# EasyEDA Pro project jlcProject.epro, schematic Schematic3
Create Date: 2025-03-28; Page Name: P1; Project Name: 电综; Schematic Name: Schematic3; Update Date: 2025-04-21; Company: 嘉立创EDA; Page Size: A4; Version: V1.0
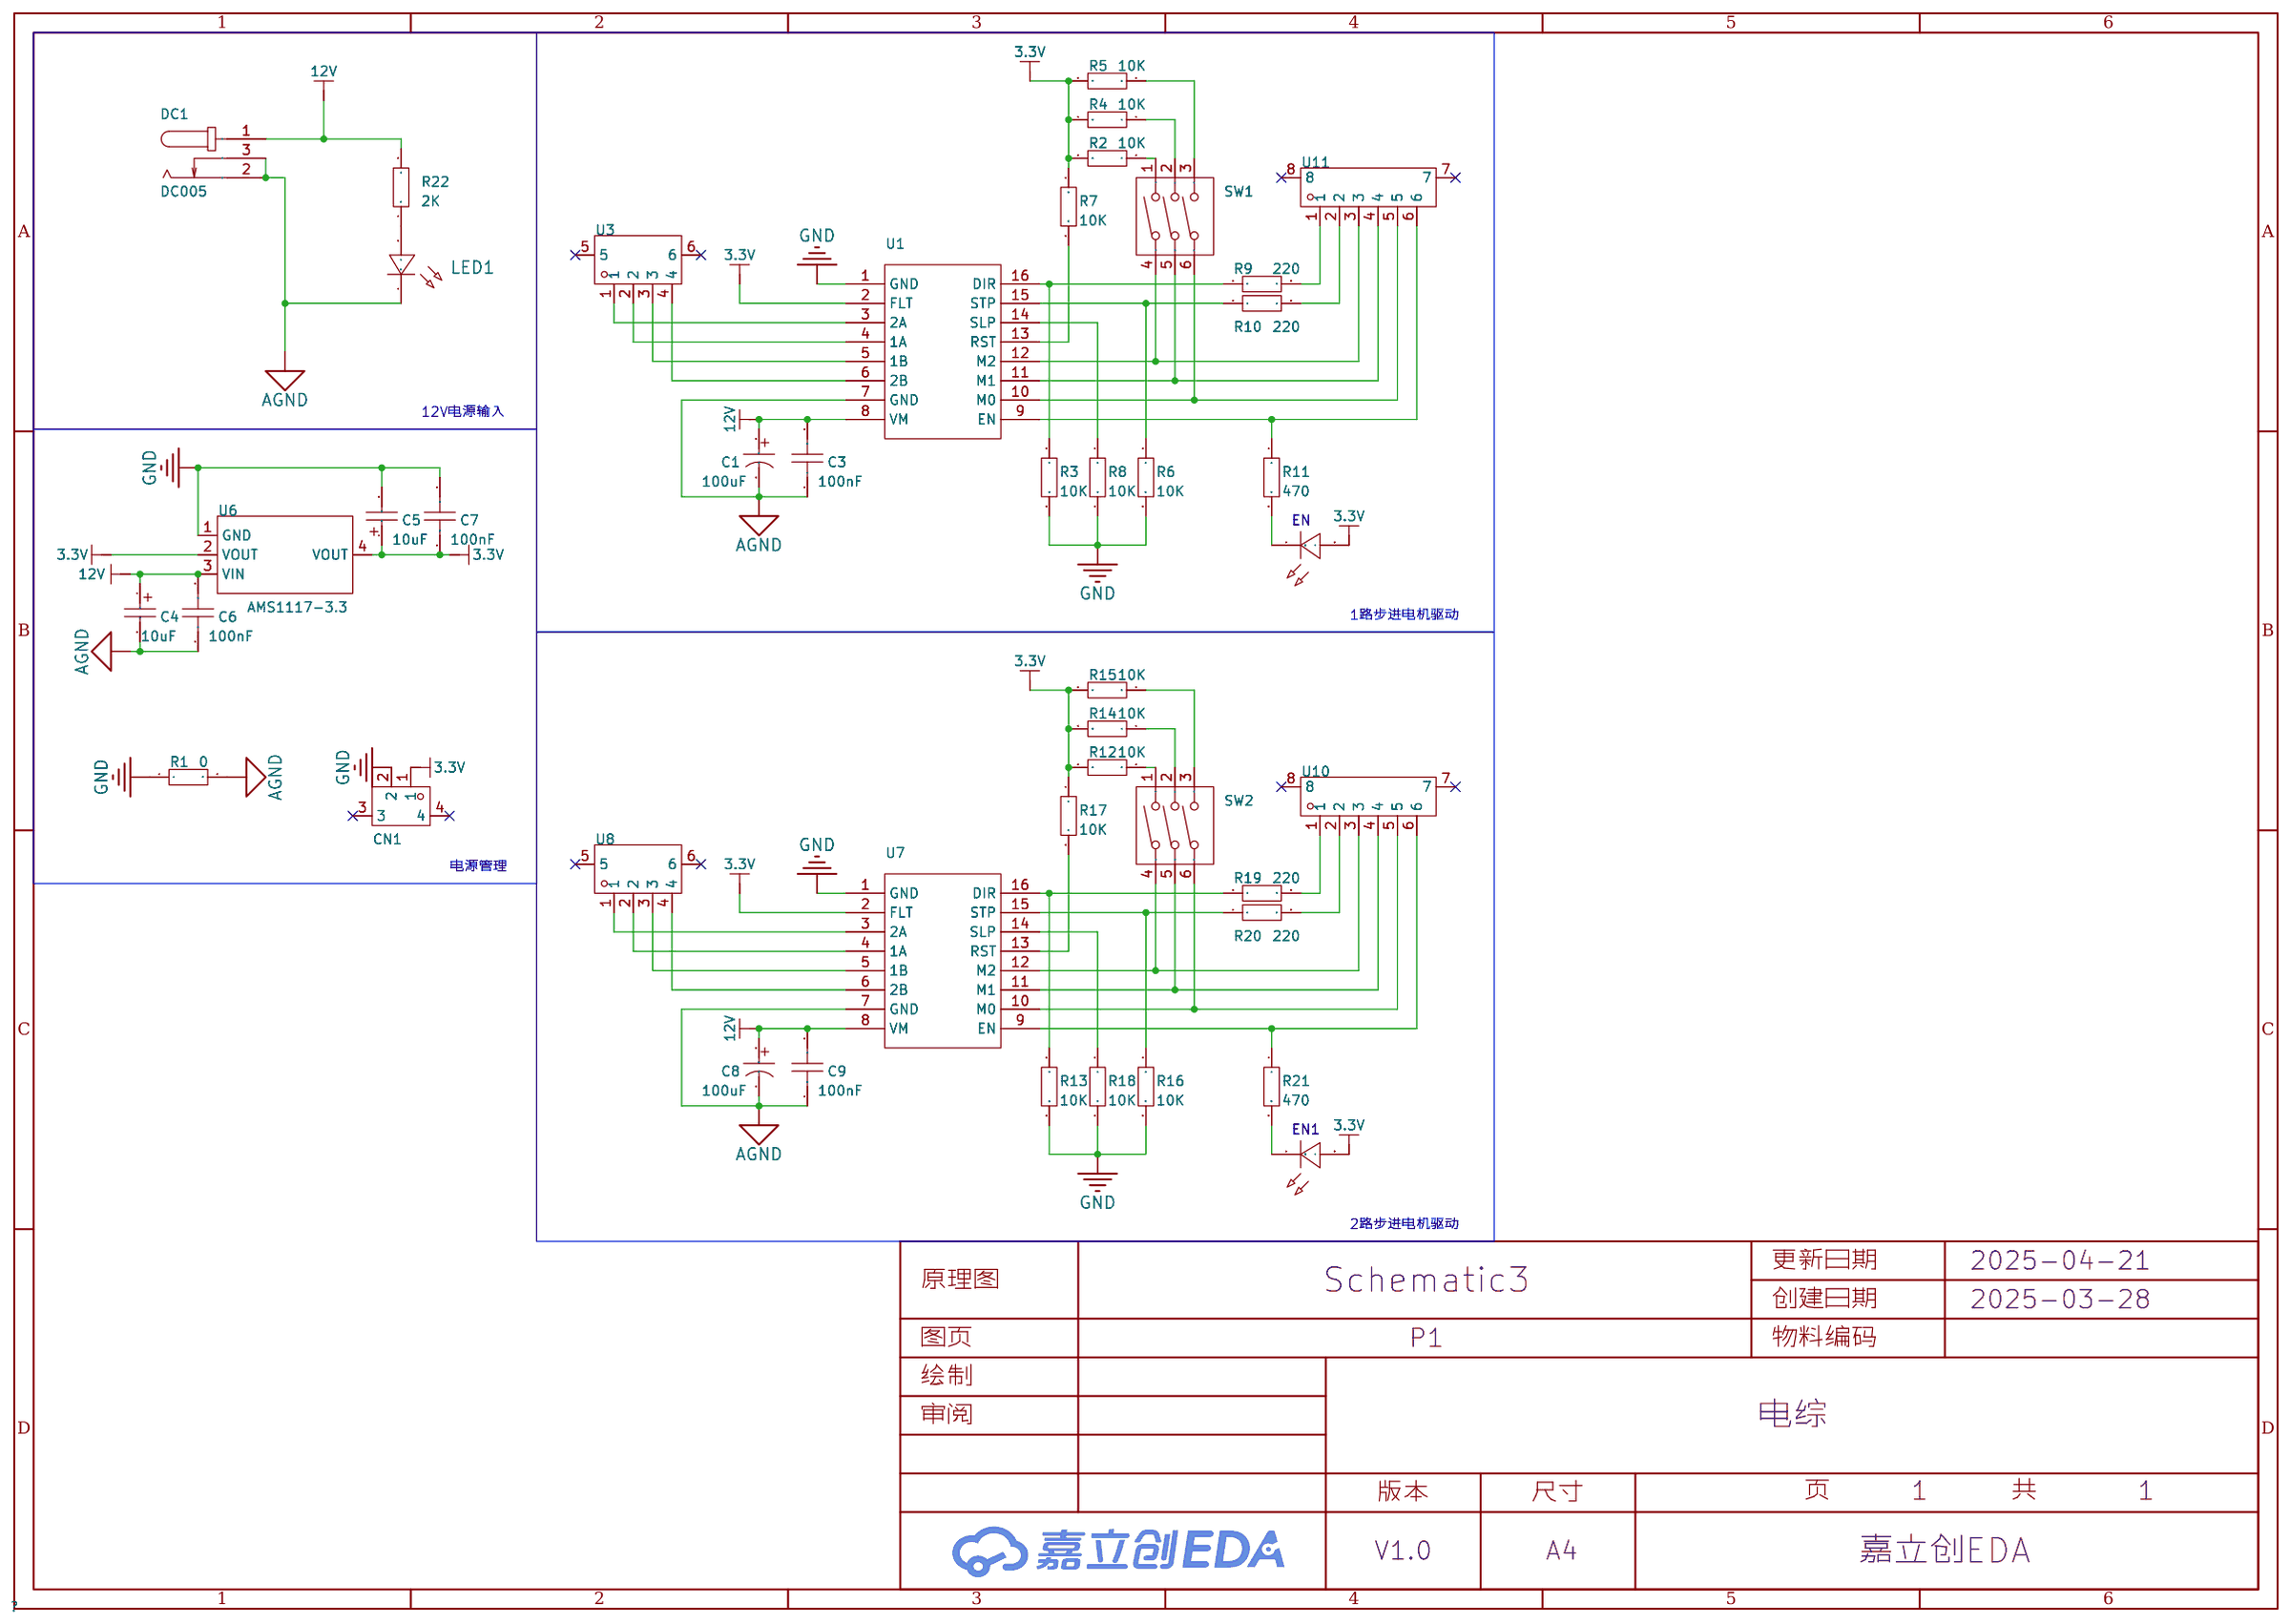
[diagram p0: schematic sheet]

## Parts
C1  100uF  [CAP-SMD_BD6.3-L6.6-W6.6-LS7.6-FD]
C3  100nF  [C0805]
C4  10uF  [CASE-D_7343]
C5  10uF  [CASE-B_3528]
C6  100nF  [C0805]
C7  100nF  [C0805]
C8  100uF  [CAP-SMD_BD6.3-L6.6-W6.6-LS7.6-FD]
C9  100nF  [C0805]
CN1  ZX-XH2.54-2PWT  [CONN-SMD_2P-P2.54_MEGASTAR_ZX-XH2.54-2PWT]
DC1  DC005  [DC-IN-TH_DC005]
EN  -  [LED_0805]
EN1  -  [LED_0805]
LED1  -  [LED_0805]
R1  0  [R0805]
R2  10K  [R0805]
R3  10K  [R0805]
R4  10K  [R0805]
R5  10K  [R0805]
R6  10K  [R0805]
R7  10K  [R0805]
R8  10K  [R0805]
R9  220  [R0805]
R10  220  [R0805]
R11  470  [R0805]
R12  10K  [R0805]
R13  10K  [R0805]
R14  10K  [R0805]
R15  10K  [R0805]
R16  10K  [R0805]
R17  10K  [R0805]
R18  10K  [R0805]
R19  220  [R0805]
R20  220  [R0805]
R21  470  [R0805]
R22  2K  [R0805]
SW1  DSWB03LHGET  [SW-TH_DSWB03LHGET]
SW2  DSWB03LHGET  [SW-TH_DSWB03LHGET]
U1  -  [DRV8825驱动模块]
U3  ZX-XH2.54-4PWT  [CONN-SMD_4P-P2.50-WAFER-254W-4P]
U6  AMS1117-3.3  [SOT-223-3_L6.5-W3.4-P2.30-LS7.0-BR]
U7  -  [DRV8825驱动模块]
U8  ZX-XH2.54-4PWT  [CONN-SMD_4P-P2.50-WAFER-254W-4P]
U10  ZX-XH2.54-6PLT  [CONN-SMD_6P-P2.50_ZX-XH2.54-6PLT]
U11  ZX-XH2.54-6PLT  [CONN-SMD_6P-P2.50_ZX-XH2.54-6PLT]

## Library data of the parts
C1 C8 = RVT1V101M0607: 容值:100uF;精度:±20%;额定电压:35V;纹波电流:69mA@120Hz;等效串联电阻(ESR):-;; LCSC Part Name: 100uF ±20% 35V; Supplier Part: C72478; Manufacturer: ROQANG(容强); Supplier Footprint: SMD,D6.3xL7.7mm; JLCPCB Part Class: Extended Part; Datasheet: https://atta.szlcsc.com/upload/public/pdf/source/20170325/1490427950282.pdf; Supplier: LCSC; Tolerance: ±20%; Voltage Rating: 35V; Ripple Current: 69mA@120Hz; Diameter: 6.3mm; Height - Seated (Max): 7.7mm; Lifetime: 2000hrs@105℃; Operating Temperature: -40℃~+105℃
C3 C6 C7 C9 = CAP_0805: Supplier Footprint: 0805
C4 = TAJD106K035RNJ: 容值:10uF;精度:±10%;额定电压:35V;等效串联电阻:1Ω@100kHz;; LCSC Part Name: 10uF ±10% 35V; Supplier Part: C7221; Manufacturer: Kyocera AVX; Supplier Footprint: CASE-D-7343; JLCPCB Part Class: Extended Part; Datasheet: https://atta.szlcsc.com/upload/public/pdf/source/20160107/1457707750344.pdf; Supplier: LCSC; Tolerance: ±10%; Rated Voltage: 35V; Equivalent Series Resistance(ESR): 1Ω@100kHz; Operating Temperature: -55℃~+125℃
C5 = TAJB106K016RNJ: 容值:10uF;精度:±10%;额定电压:16V;等效串联电阻:2.8Ω@100kHz;; LCSC Part Name: 10uF ±10% 16V; Supplier Part: C7193; Manufacturer: Kyocera AVX; Supplier Footprint: CASE-B-3528; JLCPCB Part Class: Extended Part; Datasheet: https://atta.szlcsc.com/upload/public/pdf/source/20160107/1457707750344.pdf; Supplier: LCSC; Tolerance: ±10%; Rated Voltage: 16V; Equivalent Series Resistance(ESR): 2.8Ω@100kHz; Operating Temperature: -55℃~+125℃
CN1 = ZX-XH2.54-2PWT: 插针结构:1x2P;间距:2.5mm;安装方式:卧贴;参考系列:XH;总PIN数:2P;排数:1;每排PIN数:2;行距:-;额定电流:-;触头材质:黄铜;触头镀层:锡;工作温度范围:-;; LCSC Part Name: 1x2P 间距:2.5mm 卧贴 系列:XH; Supplier Part: C7429671; Manufacturer: Megastar(兆星); Supplier Footprint: SMD,P=2.5mm,卧贴; JLCPCB Part Class: 扩展库; Datasheet: https://atta.szlcsc.com/upload/public/pdf/source/20230619/D2020A0565D707024C90AEAD14B7AF42.pdf; Supplier: LCSC; Pins Structure: 1x2P; Pitch: 2.5mm; Mounting Type: 卧贴; Reference Series: XH; Number of Pins: 2P; Number of Rows: 1; Number of PINs Per Row: 2; Contact Material: 黄铜; Contact Plating: 锡; Supplementary Features: 辅助焊脚; Color: 米色; Z-Height of the Board: 6.2mm; X-Length of Bottom Edge on Board (Spacing Line): 10mm; Y-Width of Bottom Edge on Board: 10.5mm
DC1 = DC005: 连接器类型:DC电源插座;安装方式:弯插;触点内径:2mm;触点外径:6.3mm;额定电流:500mA;额定电压:30V;工作温度范围:-25℃~+70℃;; LCSC Part Name: DC电源插座 内径:2mm 外径:6.3mm; Supplier Part: C431533; Manufacturer: SHOU HAN(首韩); Supplier Footprint: 插件; JLCPCB Part Class: Extended Part; Datasheet: https://atta.szlcsc.com/upload/public/pdf/source/20190925/C431533_4751811035784AC1D38EBC85F7905E99.pdf; Supplier: LCSC; Connector Type: DC电源插座; Mounting Style: 弯插; Inside Contact Diameter: 2mm; Outside Contact Diameter: 6.3mm; Current Rating (Max): 500mA; Voltage Rating (Max): 30V; Operating Temperature Range: -25℃~+70℃
EN EN1 = LED_0805-G: Supplier Footprint: 0805
LED1 = LED_0805-R: Supplier Footprint: 0805
R1-R22 = Res_0805: Supplier Footprint: 0805
SW1 SW2 = DSWB03LHGET: 类型:平拨,凸起式;电路结构:单刀单掷;开关位数:3位;使用寿命:-;颜色:红色;; LCSC Part Name: 间距2.54mm 平拨,凸起式 3位拨码开关; Supplier Part: C99420; Manufacturer: YE; Supplier Footprint: 插件; JLCPCB Part Class: Extended Part; Datasheet: https://atta.szlcsc.com/upload/public/pdf/source/20170330/1490854274194.pdf; Supplier: LCSC; Type: 平拨,凸起式; Circuit: 单刀单掷; Number of Positions: 3位; Lead Pitch: 2.54mm; Color: 红色
U1 U7 = DRV8825模块
U3 U8 = ZX-XH2.54-4PWT: 插针结构:1x4P;间距:2.5mm;安装方式:卧贴;参考系列:XH;总PIN数:4P;排数:1;每排PIN数:4;行距:-;额定电流:-;触头材质:黄铜;触头镀层:锡;工作温度范围:-;; LCSC Part Name: 1x4P 间距:2.5mm 卧贴 系列:XH; Supplier Part: C7429673; Manufacturer: Megastar(兆星); Supplier Footprint: SMD,P=2.5mm,卧贴; JLCPCB Part Class: Extended Part; Datasheet: https://atta.szlcsc.com/upload/public/pdf/source/20230619/EC43AB8145C2F357FC1C90A7DDB889C6.pdf; Supplier: LCSC; Pins Structure: 1x4P; Pitch: 2.5mm; Mounting Type: 卧贴; Reference Series: XH; Number of Pins: 4P; Number of Rows: 1; Number of PINs Per Row: 4; Contact Material: 黄铜; Contact Plating: 锡; Supplementary Features: 辅助焊脚; Color: 米色; Z-Height of the Board: 6.2mm; X-Length of Bottom Edge on Board (Spacing Line): 15mm; Y-Width of Bottom Edge on Board: 10.5mm
U6 = AMS1117-3.3_C6186: 输出类型:固定;工作电压:-;输出电压:3.3V;输出电流:1A;电源纹波抑制比(PSRR):72dB@(120Hz);输出极性:正极;; LCSC Part Name: 输出3.3V 1A; Supplier Part: C6186; Manufacturer: AMS; Supplier Footprint: SOT-223; JLCPCB Part Class: Basic Part; Datasheet: https://atta.szlcsc.com/upload/public/pdf/source/20180727/C6186_7A095716F0823C02F1997A905E26C086.pdf; Supplier: LCSC; Output Type: 固定; Output Voltage: 3.3V; Output Current: 1A; Power Supply Rejection Ratio (PSRR): 72dB@(120Hz); Voltage Dropout: 1.3V@(800mA); Features: 过流保护(OCP)；热关断(TSD); Output Configuration: 正极; Number of Outputs: 1
U10 U11 = ZX-XH2.54-6PLT: 插针结构:1x6P;间距:2.5mm;安装方式:立贴;参考系列:XH;总PIN数:6P;排数:1;每排PIN数:6;行距:-;额定电流:-;触头材质:黄铜;触头镀层:锡;工作温度范围:-;; LCSC Part Name: 1x6P 间距:2.5mm 立贴 系列:XH; Supplier Part: C7429684; Manufacturer: Megastar(兆星); Supplier Footprint: SMD,P=2.5mm; JLCPCB Part Class: 扩展库; Datasheet: https://atta.szlcsc.com/upload/public/pdf/source/20230619/BCBF0CFD05E3F8E61711B90D8A4988B4.pdf; Supplier: LCSC; Pins Structure: 1x6P; Pitch: 2.5mm; Mounting Type: 立贴; Reference Series: XH; Number of Pins: 6P; Number of Rows: 1; Number of PINs Per Row: 6; Contact Material: 黄铜; Contact Plating: 锡; Supplementary Features: 辅助焊脚; Color: 米色; Z-Height of the Board: 8mm; X-Length of Bottom Edge on Board (Spacing Line): 20mm; Y-Width of Bottom Edge on Board: 8.3mm

## Nets
3.3V: C5.1 C7.2 CN1.1 EN.2(A) EN1.2(A) R2.2 R4.2 R5.2 R7.1 R12.2 R14.2 R15.2 R17.1 U1.2(FLT) U6.2(VOUT) U6.4(VOUT) U7.2(FLT)
12V: C1.1 C3.2 C4.1 C6.2 C8.1 C9.2 DC1.1 R22.2 U1.8(VM) U6.3(VIN) U7.8(VM)
AGND: C1.2 C3.1 C4.2 C6.1 C8.2 C9.1 DC1.2 DC1.3 LED1.1(C) R1.2 U1.7(GND) U7.7(GND)
GND: C5.2 C7.1 CN1.2 R1.1 R3.2 R6.2 R8.2 R13.2 R16.2 R18.2 U1.1(GND) U6.1(GND) U7.1(GND)
$1N1102: U1.3(2A) U3.1
$1N1109: U1.4(1A) U3.2
$1N1116: U1.5(1B) U3.3
$1N1123: U1.6(2B) U3.4
$1N1274: R11.1 U1.9(EN) U11.6
$1N1506: SW1.4 U1.12(M2) U11.3
$1N1515: SW1.5 U1.11(M1) U11.4
$1N1524: SW1.6 U1.10(M0) U11.5
$1N1862: R4.1 SW1.2
$1N1866: R5.1 SW1.3
$1N1873: R2.1 SW1.1
$1N1945: R7.2 U1.13(RST)
$1N1999: R8.1 U1.14(SLP)
$1N2088: R10.2 U11.2
$1N2106: R3.1 R9.1 U1.16(DIR)
$1N2111: R6.1 R10.1 U1.15(STP)
$1N2116: R9.2 U11.1
$1N2168: EN.1(C) R11.2
$1N4183: U7.3(2A) U8.1
$1N4184: U7.4(1A) U8.2
$1N4185: U7.5(1B) U8.3
$1N4186: U7.6(2B) U8.4
$1N4187: R21.1 U7.9(EN) U10.6
$1N4188: SW2.4 U7.12(M2) U10.3
$1N4189: SW2.5 U7.11(M1) U10.4
$1N4190: SW2.6 U7.10(M0) U10.5
$1N4193: R14.1 SW2.2
$1N4194: R15.1 SW2.3
$1N4195: R12.1 SW2.1
$1N4196: R17.2 U7.13(RST)
$1N4197: R18.1 U7.14(SLP)
$1N4198: R20.2 U10.2
$1N4199: R13.1 R19.1 U7.16(DIR)
$1N4200: R16.1 R20.1 U7.15(STP)
$1N4201: R19.2 U10.1
$1N4202: EN1.1(C) R21.2
$1N4282: LED1.2(A) R22.1

Not connected (* = marked no-connect by the designer): CN1 3* 4*; U3 5* 6*; U8 5* 6*; U10 7* 8*; U11 7* 8*

## Notes on the sheet
- 12V电源输入
- 1路步进电机驱动
- 电源管理
- 2路步进电机驱动
